# EasyEDA schematic digital clock no resistors.json
TITLE: Digital Clock Schematics; REV: 1.0; Date: 2021-03-11; Sheet: 1/1; Drawn By: QueenOfTheNorth; Company: Your Company
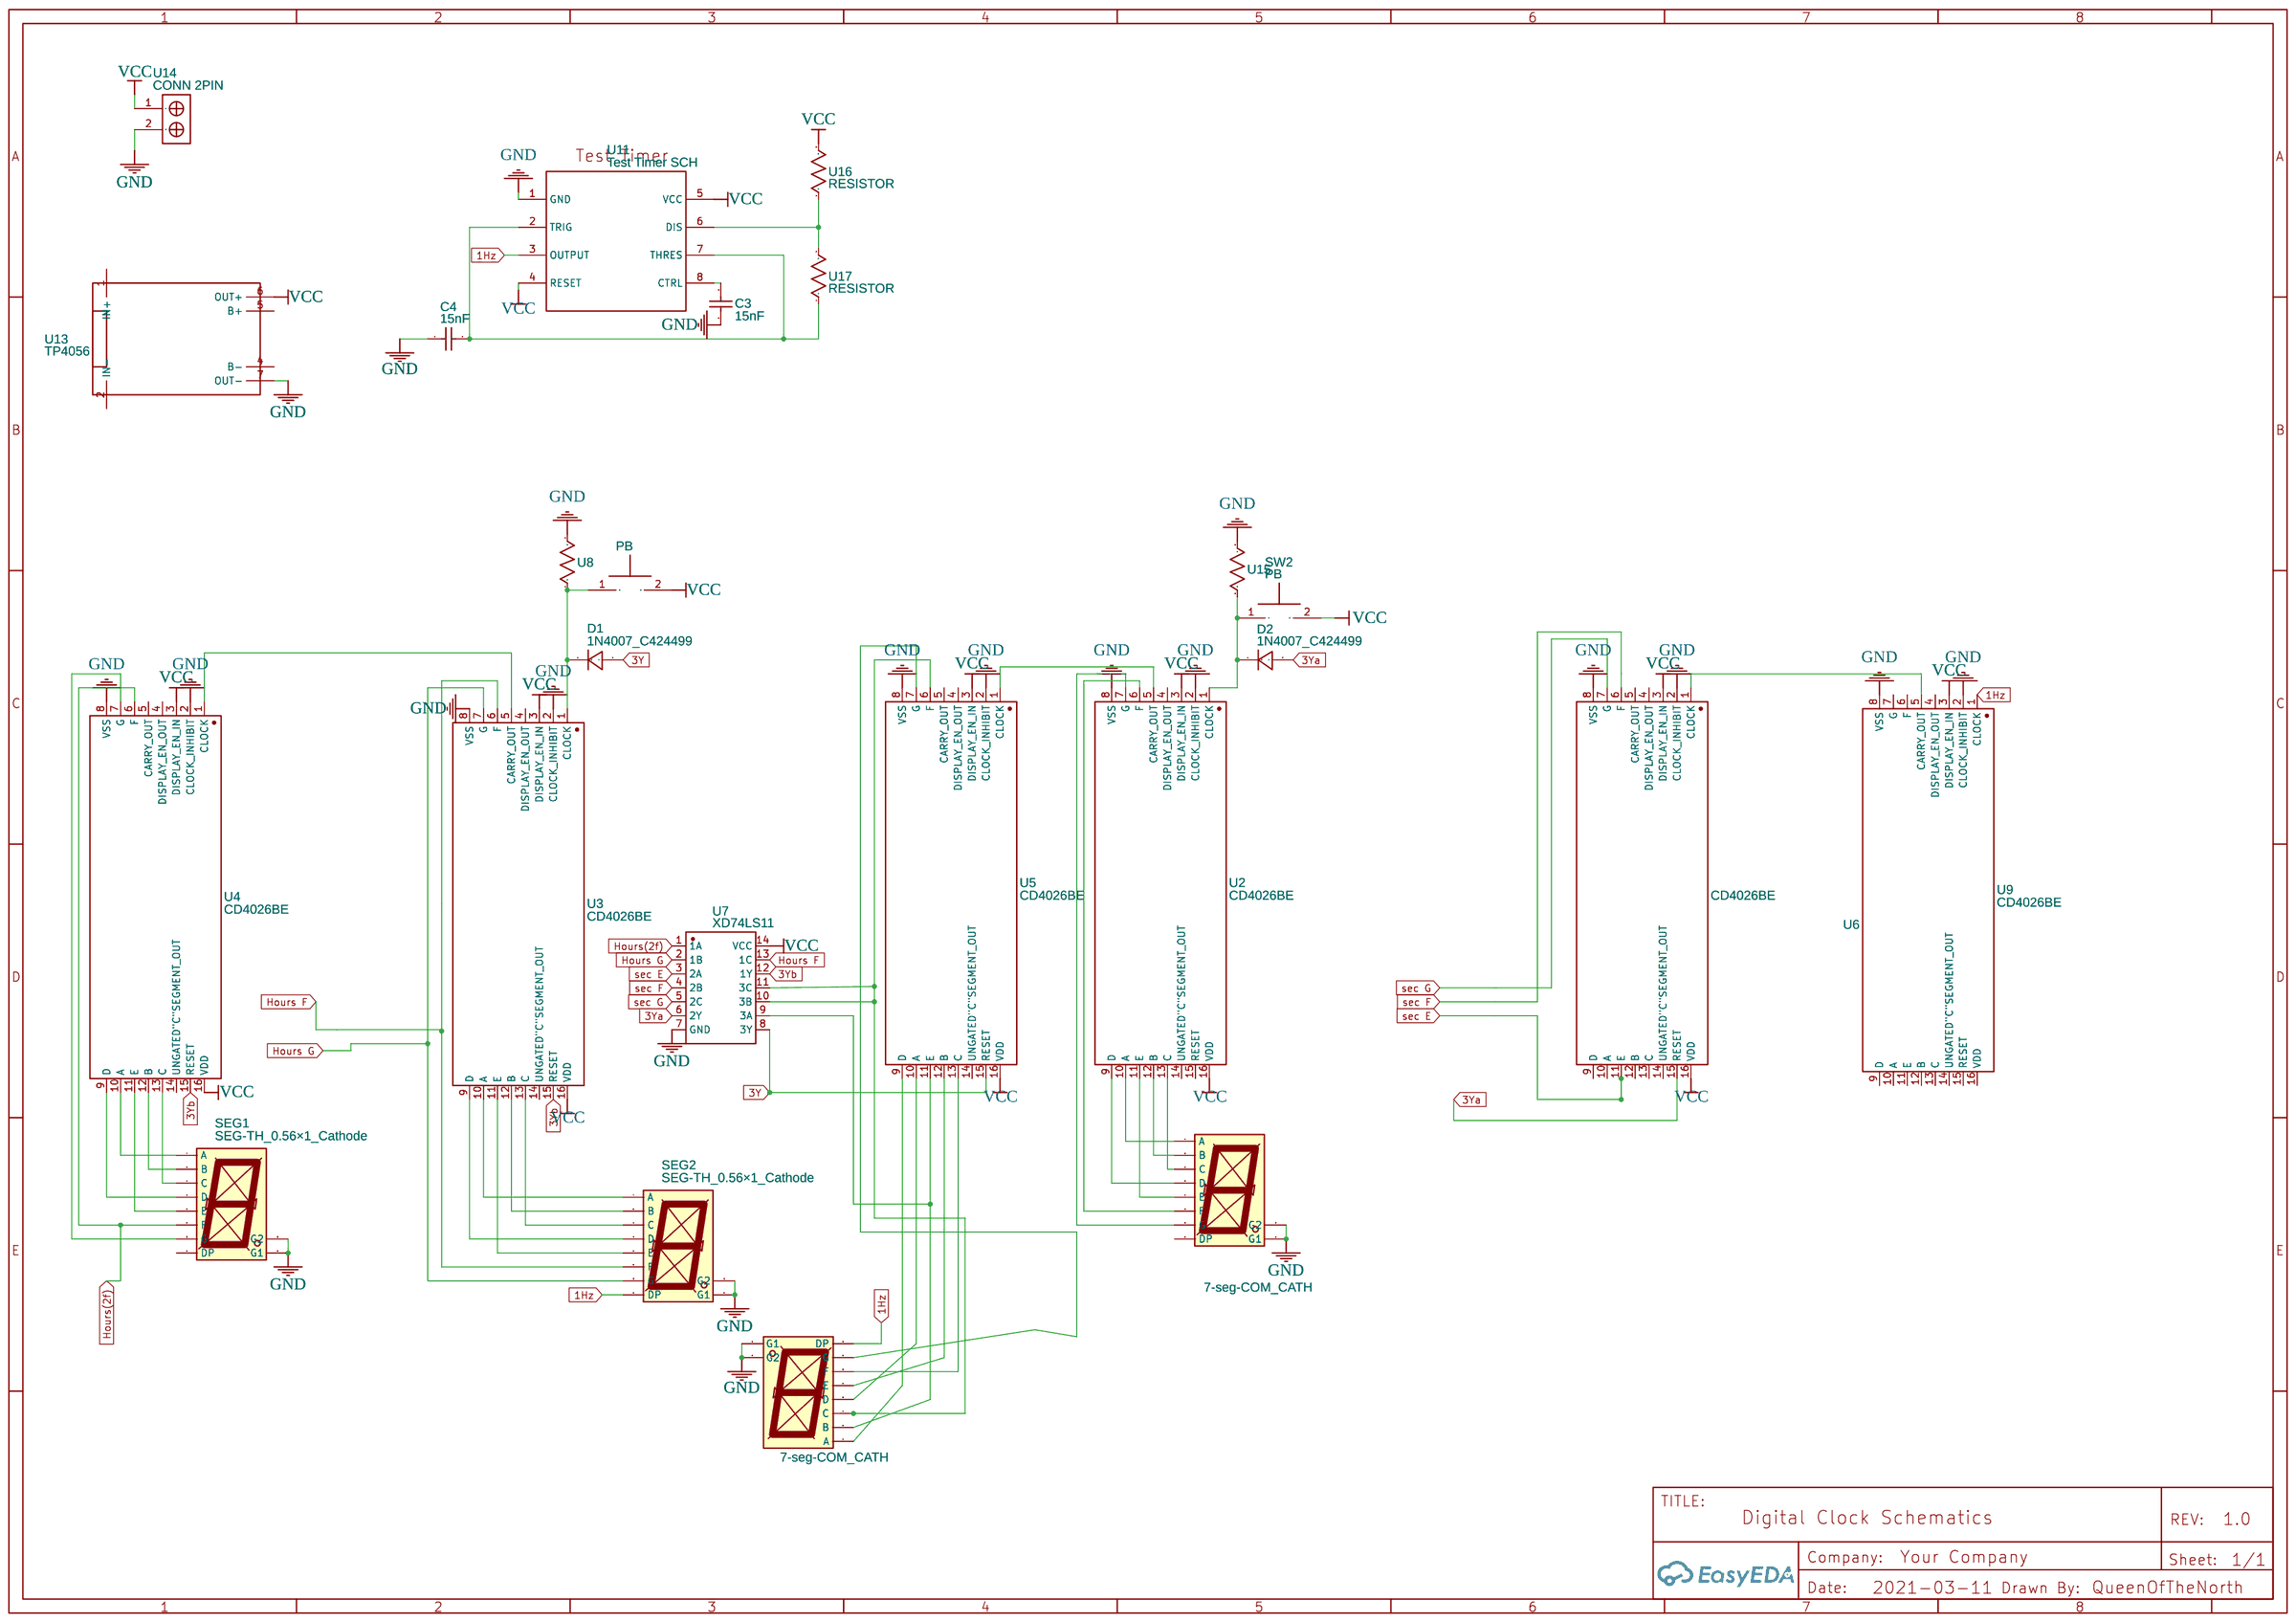
[diagram p0: schematic sheet]

## Parts
C3  15nF  [CAP-TH_L6.5-W4.0-P5.00-D1.0]
C4  15nF  [CAP-TH_L6.5-W4.0-P5.00-D1.0]
D1  1N4007_C424499  [DO-41_BD2.4-L4.7-P8.70-D0.9-RD]
D2  1N4007_C424499  [DO-41_BD2.4-L4.7-P8.70-D0.9-RD]
SEG1  SEG-TH_0.56×1_Cathode  [LED-SEG-TH_10P-L12.6-W19.0-P2.54-S15.24-BL]
SEG2  SEG-TH_0.56×1_Cathode  [LED-SEG-TH_10P-L12.6-W19.0-P2.54-S15.24-BL]
SEG3  7-seg-COM_CATH  [LED-SEG-TH_10P-L12.6-W19.0-P2.54-S15.24-BL]
SEG4  7-seg-COM_CATH  [LED-SEG-TH_10P-L12.6-W19.0-P2.54-S15.24-BL]
SW1  PB  [PUSH BUTTON]
SW2  PB  [PUSH BUTTON]
U2  CD4026BE  [DIP-16_L20.3-W10.2-P2.54-LS10.2-BL]
U3  CD4026BE  [DIP-16_L20.3-W10.2-P2.54-LS10.2-BL]
U4  CD4026BE  [DIP-16_L20.3-W10.2-P2.54-LS10.2-BL]
U5  CD4026BE  [DIP-16_L20.3-W10.2-P2.54-LS10.2-BL]
U6  CD4026BE  [DIP-16_L20.3-W10.2-P2.54-LS10.2-BL]
U7  XD74LS11  [DIP-14_L19.4-W6.4-P2.54-LS7.6-BL]
U8  RESISTOR  [0.4W 1% RESISTOR]
U9  CD4026BE  [DIP-16_L20.3-W10.2-P2.54-LS10.2-BL]
U11  Test Timer SCH  [IC  555]
U13  TP4056  [TP4056-PROTECT]
U14  CONN 2PIN  [TERMINAL_BLOCK_KF762-3P]
U15  RESISTOR  [0.4W 1% RESISTOR]
U16  RESISTOR  [0.4W 1% RESISTOR]
U17  RESISTOR  [0.4W 1% RESISTOR]

## Library data of the parts
C3 C4 = CAPACITOR15NF100V: Supplier: LCSC; Manufacturer: ReliaPro; Manufacturer Part: Capacitor15nf100v; Contributor: LCSC; Supplier Part: C26191
D1 D2 = 1N4007_C424499: Supplier: LCSC; Supplier Part: C424499; Manufacturer: SUNMATE Elec; Manufacturer Part: 1N4007; Contributor: LCSC; LCSC Assembly: Yes; SMT Type: Extend; Assembly Type: manualWeld; Paste Type: expand
SEG1-SEG4 = SEG-TH_0.56×1_Cathode: Manufacturer: 志浩; Supplier Part: C8093; Contributor: LCEDA_01
SW1 SW2 = PB: Manufacturer Part: Push button; Contributor: JoseQuintanilla
U2-U6 U9 = CD4026BE: Supplier: LCSC; Manufacturer: TI; Supplier Part: C89909; LCSC Assembly: Yes; SMT Type: Extend; Assembly Type: manualWeld; Paste Type: expand
U7 = XD74LS11: Supplier: LCSC; Supplier Part: C521167; Manufacturer: XINLUDA(信路达); Contributor: LCSC
U8 U15-U17 = RESISTOR: Contributor: dannyjacket
U11 = Test Timer SCH: Manufacturer Part: 555 Timer; Contributor: ST Team
U13 = TP4056: Manufacturer Part: TP4056-protect; link: https://dlnmh9ip6v2uc.cloudfront.net/datasheets/Prototyping/TP4056.pdf; Contributor: quocanhhai
U14 = CONN 2PIN: Manufacturer Part: Terminal Block; Supplier Part: undefined; Contributor: bangnaga

## Nets
GND: C3.1 C4.1 SEG1.3(G1) SEG1.8(G2) SEG2.3(G1) SEG2.8(G2) SEG3.3(G1) SEG3.8(G2) SEG4.3(G1) SEG4.8(G2) U2.2(CLOCK_INHIBIT) U2.8(VSS) U3.2(CLOCK_INHIBIT) U3.8(VSS) U4.2(CLOCK_INHIBIT) U4.8(VSS) U5.2(CLOCK_INHIBIT) U5.8(VSS) U6.2(CLOCK_INHIBIT) U6.8(VSS) U7.7(GND) U8.2 U9.2(CLOCK_INHIBIT) U9.8(VSS) U11.1(GND) U13.7(OUT-) U14.2 U15.2
VCC: SW1.2 SW2.2 U2.3(DISPLAY_EN_IN) U2.16(VDD) U3.3(DISPLAY_EN_IN) U3.16(VDD) U4.3(DISPLAY_EN_IN) U4.16(VDD) U5.3(DISPLAY_EN_IN) U5.16(VDD) U6.3(DISPLAY_EN_IN) U6.16(VDD) U7.14(VCC) U9.3(DISPLAY_EN_IN) U11.4(RESET) U11.5(VCC) U13.6(OUT+) U14.1 U16.2
1Hz: SEG2.5(DP) SEG3.5(DP) U9.1(CLOCK) U11.3(OUTPUT)
3Y: D1.2(A) U5.15(RESET) U7.8(3Y)
3Ya: D2.2(A) U6.15(RESET) U7.6(2Y)
3Yb: U3.15(RESET) U4.15(RESET) U7.12(1Y)
Hours F: SEG2.9(F) U3.6(F) U7.13(1C)
Hours G: SEG2.10(G) U3.7(G) U7.2(1B)
Hours(2f): SEG1.9(F) U4.6(F) U7.1(1A)
sec E: U6.11(E) U7.3(2A)
sec F: U6.6(F) U7.4(2B)
sec G: U6.7(G) U7.5(2C)
Net-(C3-2): C3.2 U11.8(CTRL)
Net-(C4-2): C4.2 U11.2(TRIG) U11.7(THRES) U17.1
Net-(D1-1): D1.1(C) SW1.1 U3.1(CLOCK) U8.1
Net-(D2-1): D2.1(C) SW2.1 U2.1(CLOCK) U15.1
Net-(SEG1-1): SEG1.1(E) U4.11(E)
Net-(SEG1-2): SEG1.2(D) U4.9(D)
Net-(SEG1-4): SEG1.4(C) U4.13(C)
Net-(SEG1-6): SEG1.6(B) U4.12(B)
Net-(SEG1-7): SEG1.7(A) U4.10(A)
Net-(SEG1-10): SEG1.10(G) U4.7(G)
Net-(SEG2-1): SEG2.1(E) U3.11(E)
Net-(SEG2-2): SEG2.2(D) U3.9(D)
Net-(SEG2-4): SEG2.4(C) U3.13(C)
Net-(SEG2-6): SEG2.6(B) U3.12(B)
Net-(SEG2-7): SEG2.7(A) U3.10(A)
Net-(SEG3-1): SEG3.1(E) U5.12(B)
Net-(SEG3-2): SEG3.2(D) U5.10(A)
Net-(SEG3-4): SEG3.4(C) U5.6(F) U7.10(3B) U7.11(3C)
Net-(SEG3-6): SEG3.6(B) U5.11(E) U7.9(3A)
Net-(SEG3-7): SEG3.7(A) U5.9(D)
Net-(SEG3-9): SEG3.9(F) U5.13(C)
Net-(SEG3-10): SEG3.10(G) U5.7(G)
Net-(SEG4-1): SEG4.1(E) U2.11(E)
Net-(SEG4-2): SEG4.2(D) U2.9(D)
Net-(SEG4-4): SEG4.4(C) U2.13(C)
Net-(SEG4-6): SEG4.6(B) U2.12(B)
Net-(SEG4-7): SEG4.7(A) U2.10(A)
Net-(SEG4-9): SEG4.9(F) U2.6(F)
Net-(SEG4-10): SEG4.10(G) U2.7(G)
Net-(U2-5): U2.5(CARRY_OUT) U5.1(CLOCK)
Net-(U3-5): U3.5(CARRY_OUT) U4.1(CLOCK)
Net-(U6-1): U6.1(CLOCK) U9.5(CARRY_OUT)
Net-(U11-6): U11.6(DIS) U16.1 U17.2

Not connected (* = marked no-connect by the designer): SEG1 5(DP); SEG4 5(DP); U2 4(DISPLAY_EN_OUT) 14(UNGATED"C"SEGMENT_OUT) 15(RESET); U3 4(DISPLAY_EN_OUT) 14(UNGATED"C"SEGMENT_OUT); U4 4(DISPLAY_EN_OUT) 5(CARRY_OUT) 14(UNGATED"C"SEGMENT_OUT); U5 4(DISPLAY_EN_OUT) 5(CARRY_OUT) 14(UNGATED"C"SEGMENT_OUT); U6 4(DISPLAY_EN_OUT) 5(CARRY_OUT) 9(D) 10(A) 12(B) 13(C) 14(UNGATED"C"SEGMENT_OUT); U9 4(DISPLAY_EN_OUT) 6(F) 7(G) 9(D) 10(A) 11(E) 12(B) 13(C) 14(UNGATED"C"SEGMENT_OUT) 15(RESET) 16(VDD); U13 1(IN+) 2(IN-) 4(B-) 5(B+)
